# Altium schematic sheet 连接.SchDoc
size A4
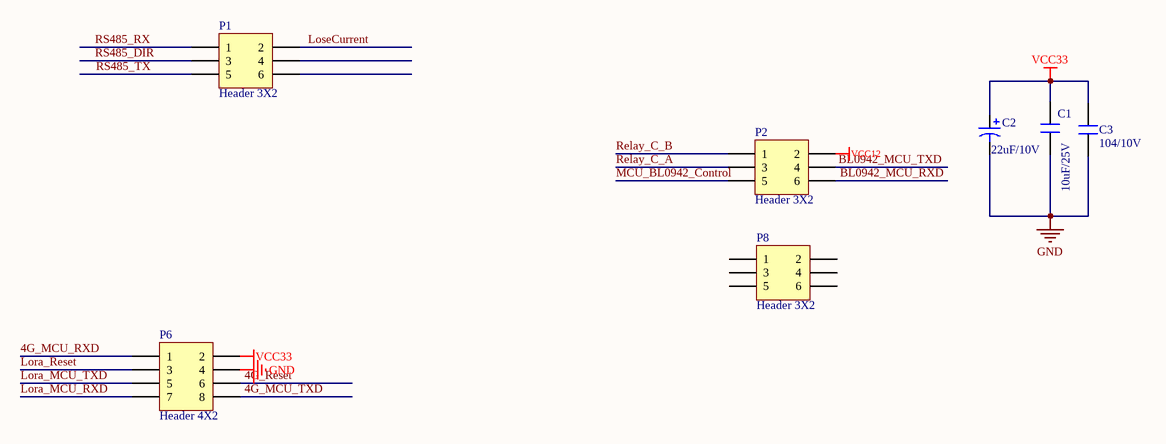
[diagram p0: 连接.SchDoc]

## Parts
C1  10uF/25V  [0603R]
C2  22uF/10V  [0805R]
C3  104/10V  [0603R]
P1  Header 3X2  [CONN-SMD_5BME8-08872-203-W0]
P2  Header 3X2  [CONN-SMD_5BME8-08872-203-W0]
P6  Header 4X2  [CONN-SMD_5BME8-08872-204-W0]
P8  Header 3X2  [CONN-SMD_5BME8-08872-203-W0]

## Nets
GND: C1.1 C2.2 C3.1 P6.4
VCC12: P2.2
VCC33: C1.2 C2.1 C3.2 P6.2
4G_MCU_RXD: P6.1
4G_MCU_TXD: P6.8
4G_Reset: P6.6
BL0942_MCU_RXD: P2.6
BL0942_MCU_TXD: P2.4
Lora_MCU_RXD: P6.7
Lora_MCU_TXD: P6.5
Lora_Reset: P6.3
LoseCurrent: P1.2
MCU_BL0942_Control: P2.5
Relay_C_A: P2.3
Relay_C_B: P2.1
RS485_DIR: P1.3
RS485_RX: P1.1
RS485_TX: P1.5

Not connected (* = marked no-connect by the designer): P1 4 6; P8 1 2 3 4 5 6

## Library data of the parts
C1 = CAP
C2 = Cap Pol1: Polarized Capacitor (Radial); Published: 8-Jun-2000; LatestRevisionDate: 17-Jul-2002; LatestRevisionNote: Re-released for DXP Platform.; PackageReference: RB7.6-15; Publisher: Altium Limited; PackageDescription: Polarized Capacitor (Radial); 2 Leads
C3 = CAP_1
P1 P2 P8 = Header 3X2: Header, 3-Pin, Dual row; LatestRevisionDate: 17-Jul-2002; LatestRevisionNote: Re-released for DXP Platform.; Publisher: Altium Limited
P6 = Header 4X2: Header, 4-Pin, Dual row; LatestRevisionDate: 17-Jul-2002; LatestRevisionNote: Re-released for DXP Platform.; Publisher: Altium Limited